# Altium schematic sheet USB_to_Serial.SchDoc
size A4; CompanyName: SPAN; Engineer: Goverdhan; Organization: University of Utah; Address1: 50 S Central Campus Dr; Address2: MEB Rm 3129; Address3: Salt Lake City, Utah 84115; Address4: USA; Revision: 1; SheetNumber: 4; SheetTotal: 5
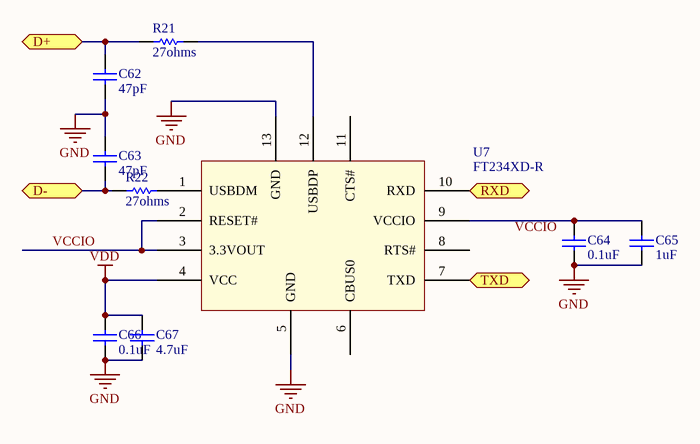
[diagram p0: USB_to_Serial.SchDoc]

## Parts
C62  47pF  [0603_Cap]
C63  47pF  [0603_Cap]
C64  0.1uF  [0603_Cap]
C65  1uF  [0603_Cap]
C66  0.1uF  [0603_Cap]
C67  4.7uF  [0603_Cap]
R21  27ohms  [0603_RES]
R22  27ohms  [0603_RES]
U7  FT234XD-R  [DFN_12_FT234XD]

## Ports
D+ (bidir), D- (bidir), RXD, TXD

## Nets
GND: C62.1 C63.2 C64.1 C65.1 C66.1 C67.1 U7.5(GND) U7.13(GND)
VDD: C66.2 C67.2 U7.4(VCC)
D+: C62.2 R21.1 ; port D+
D-: C63.1 R22.1 ; port D-
RXD: U7.10(RXD) ; port RXD
TXD: U7.7(TXD) ; port TXD
VCCIO: U7.2(RESET#) U7.3(3.3VOUT)
NetC64_2: C64.2 C65.2 U7.9(VCCIO)
NetR21_2: R21.2 U7.12(USBDP)

Not connected (* = marked no-connect by the designer): R22 2; U7 1(USBDM) 6(CBUS0) 8(RTS#) 11(CTS#)

## Notes on the sheet
- Labels drawn without touching a wire or pin: VCCIO
- Title
- Designed by:
- Date:
- Time:
- Revision:
- Sheet
- of
- File:

## Library data of the parts
C62 C63 = 060321500470FQTLSM: CAP CER 47PF 150V C0G/NP0 0603; Manufacturer: Knowles Syfer; Tolerance: ±1%; Temperature Coefficient: C0G, NP0; Supplier 1: Digi-Key; Manufacturer Part Number: 060321500470FQTLSM; RoHS: RoHS Compliant; Category: Capacitors; Stock 1: 0; Pricing 1: 4000=0.11332, 8000=0.10666, 12000=0.10332, 28000=0.09999, 100000=0.08866 (USD); Packaging: Tape & Reel (TR); Part Status: Active; Capacitance: 47pF; Voltage - Rated: 150V; Operating Temperature: -55°C ~ 125°C; Features: High Q, Low Loss, Non-Magnetic; Ratings: -; Applications: Automotive; Failure Rate: -; Mounting Type: Surface Mount, MLCC; Package / Case: 0603 (1608 Metric); Size / Dimension: 0.063" L x 0.031" W (1.60mm x 0.80mm); Height - Seated (Max): -; Thickness (Max): 0.031" (0.80mm); Lead Spacing: -; Lead Style: -; ComponentLink1URL: http://www.knowlescapacitors.com/File%20Library/Syfer/English/Product%20Navigation/Product%20Family%20Datasheet/Non-magneticDatasheet.pdf; ComponentLink1Description: http://www.knowlescapacitors.com/File%20Library/Syfer/English/Product%20Navigation/Product%20Family%20Datasheet/Non-magneticDatasheet.pdf; Supplier Part Number 1: 1608-1259-2-ND
C64 C66 = 0603YC104KAT4A: CAP CER 0.1UF 16V X7R 0603; Manufacturer: AVX Corporation; Capacitance: 0.1µF; Tolerance: ±10%; Supplier 1: Digi-Key; Manufacturer Part Number: 0603YC104KAT4A; RoHS: RoHS Compliant; Category: Capacitors; Stock 1: 15000; Pricing 1: 15000=0.00344, 30000=0.00327, 75000=0.00292, 105000=0.00237 (USD); Packaging: Tape & Reel (TR); Part Status: Active; Voltage - Rated: 16V; Temperature Coefficient: X7R; Operating Temperature: -55°C ~ 125°C; Features: -; Ratings: -; Applications: General Purpose; Failure Rate: -; Mounting Type: Surface Mount, MLCC; Package / Case: 0603 (1608 Metric); Size / Dimension: 0.063" L x 0.032" W (1.60mm x 0.81mm); Height - Seated (Max): -; Thickness (Max): 0.035" (0.90mm); Lead Spacing: -; Lead Style: -; ComponentLink1URL: http://datasheets.avx.com/X7RDielectric.pdf; ComponentLink1Description: http://datasheets.avx.com/X7RDielectric.pdf; Supplier Part Number 1: 478-10054-2-ND
C65 = JMK107C6105KA-T: CAP CER 1uF SMD; Manufacturer: Taiyo Yuden; Capacitance: 1µF; Tolerance: ±10%; Voltage - Rated: 6.3V; Temperature Coefficient: X6S; Supplier 1: Digi-Key; Manufacturer Part Number: JMK107C6105KA-T; RoHS: RoHS Compliant; Category: Capacitors; Stock 1: 8000; Pricing 1: 4000=0.02281, 8000=0.02122, 12000=0.02016, 28000=0.0191, 100000=0.01446 (USD); Packaging: Tape & Reel (TR); Part Status: Active; Operating Temperature: -55°C ~ 105°C; Features: -; Ratings: -; Applications: SMPS Filtering; Failure Rate: -; Mounting Type: Surface Mount, MLCC; Package / Case: 0603 (1608 Metric); Size / Dimension: 0.063" L x 0.031" W (1.60mm x 0.80mm); Height - Seated (Max): -; Thickness (Max): 0.035" (0.90mm); Lead Spacing: -; Lead Style: -; ComponentLink1URL: http://www.yuden.co.jp/productdata/catalog/en/mlcc_all_e.pdf; ComponentLink1Description: http://www.yuden.co.jp/productdata/catalog/en/mlcc_all_e.pdf; Supplier Part Number 1: 587-4904-2-ND
C67 = JMK107BJ475MAHT: Manufacturer: Taiyo Yuden; Capacitance: 4.7µF; Tolerance: ±20%; Voltage - Rated: 6.3V; Temperature Coefficient: X5R; Supplier 1: Digi-Key; Manufacturer Part Number: JMK107BJ475MAHT; RoHS: RoHS Compliant; Category: Capacitors; Stock 1: 4000; Pricing 1: 4000=0.03053, 8000=0.0284, 12000=0.02698, 28000=0.02556, 100000=0.01935 (USD); Packaging: Tape & Reel (TR); Part Status: Active; Operating Temperature: -55°C ~ 85°C; Features: -; Ratings: AEC-Q200; Applications: Automotive, SMPS Filtering; Failure Rate: -; Mounting Type: Surface Mount, MLCC; Package / Case: 0603 (1608 Metric); Size / Dimension: 0.063" L x 0.031" W (1.60mm x 0.80mm); Height - Seated (Max): -; Thickness (Max): 0.035" (0.90mm); Lead Spacing: -; Lead Style: -; ComponentLink1URL: http://www.yuden.co.jp/productdata/catalog/en/mlcc_all_hq_e.pdf; ComponentLink1Description: http://www.yuden.co.jp/productdata/catalog/en/mlcc_all_hq_e.pdf; Supplier Part Number 1: 587-4903-2-ND
R21 R22 = RT0603BRB0727RL: RES SMD 27 OHM 0.1% 1/10W 0603; Manufacturer: Yageo; Resistance (Ohms): 27; Power (Watts): 0.1W, 1/10W; Temperature Coefficient: ±10ppm/°C; Supplier 1: Digi-Key; Manufacturer Part Number: RT0603BRB0727RL; RoHS: RoHS Compliant; Category: Resistors; Stock 1: 0; Pricing 1: 5000=0.13183, 10000=0.12662, 25000=0.12411, 50000=0.12281 (USD); Packaging: Tape & Reel (TR); Part Status: Active; Tolerance: ±0.1%; Composition: Thin Film; Features: Moisture Resistant; Operating Temperature: -55°C ~ 155°C; Package / Case: 0603 (1608 Metric); Supplier Device Package: 0603; Size / Dimension: 0.063" L x 0.032" W (1.60mm x 0.80mm); Height - Seated (Max): 0.022" (0.55mm); Number of Terminations: 2; Failure Rate: -; ComponentLink1URL: http://www.yageo.com/documents/recent/PYu-RT_1-to-0.05_RoHS_L_7.pdf; ComponentLink1Description: http://www.yageo.com/documents/recent/PYu-RT_1-to-0.05_RoHS_L_7.pdf; Supplier Part Number 1: YAG4441TR-ND
U7 = FT234XD-R: IC USB SERIAL BASIC UART 12DFN; Manufacturer: FTDI, Future Technology Devices International Ltd; Function: Bridge, USB to UART; Standards: USB 2.0; Voltage - Supply: 2.97 V ~ 5.5 V; Current - Supply: 8mA; Supplier 1: Digi-Key; RoHS: RoHS Compliant; Category: Integrated Circuits (ICs); Stock 1: 50000; Pricing 1: 5000=1.4375 (USD); Packaging: Tape & Reel (TR); Part Status: Active; Protocol: USB; Interface: UART; Operating Temperature: -40°C ~ 85°C; Package / Case: 12-VFDFN Exposed Pad; Supplier Device Package: 12-DFN (3x3); ComponentLink1URL: http://www.ftdichip.com/Support/Documents/DataSheets/ICs/DS_FT234XD.pdf; ComponentLink1Description: http://www.ftdichip.com/Support/Documents/DataSheets/ICs/DS_FT234XD.pdf; Supplier Part Number 1: 768-1178-2-ND; Manufacturer Part Number: FT234XD-R